# EAGLE design H1DR21 (EAGLE 9.6.1)

## Sheet 1 of 2
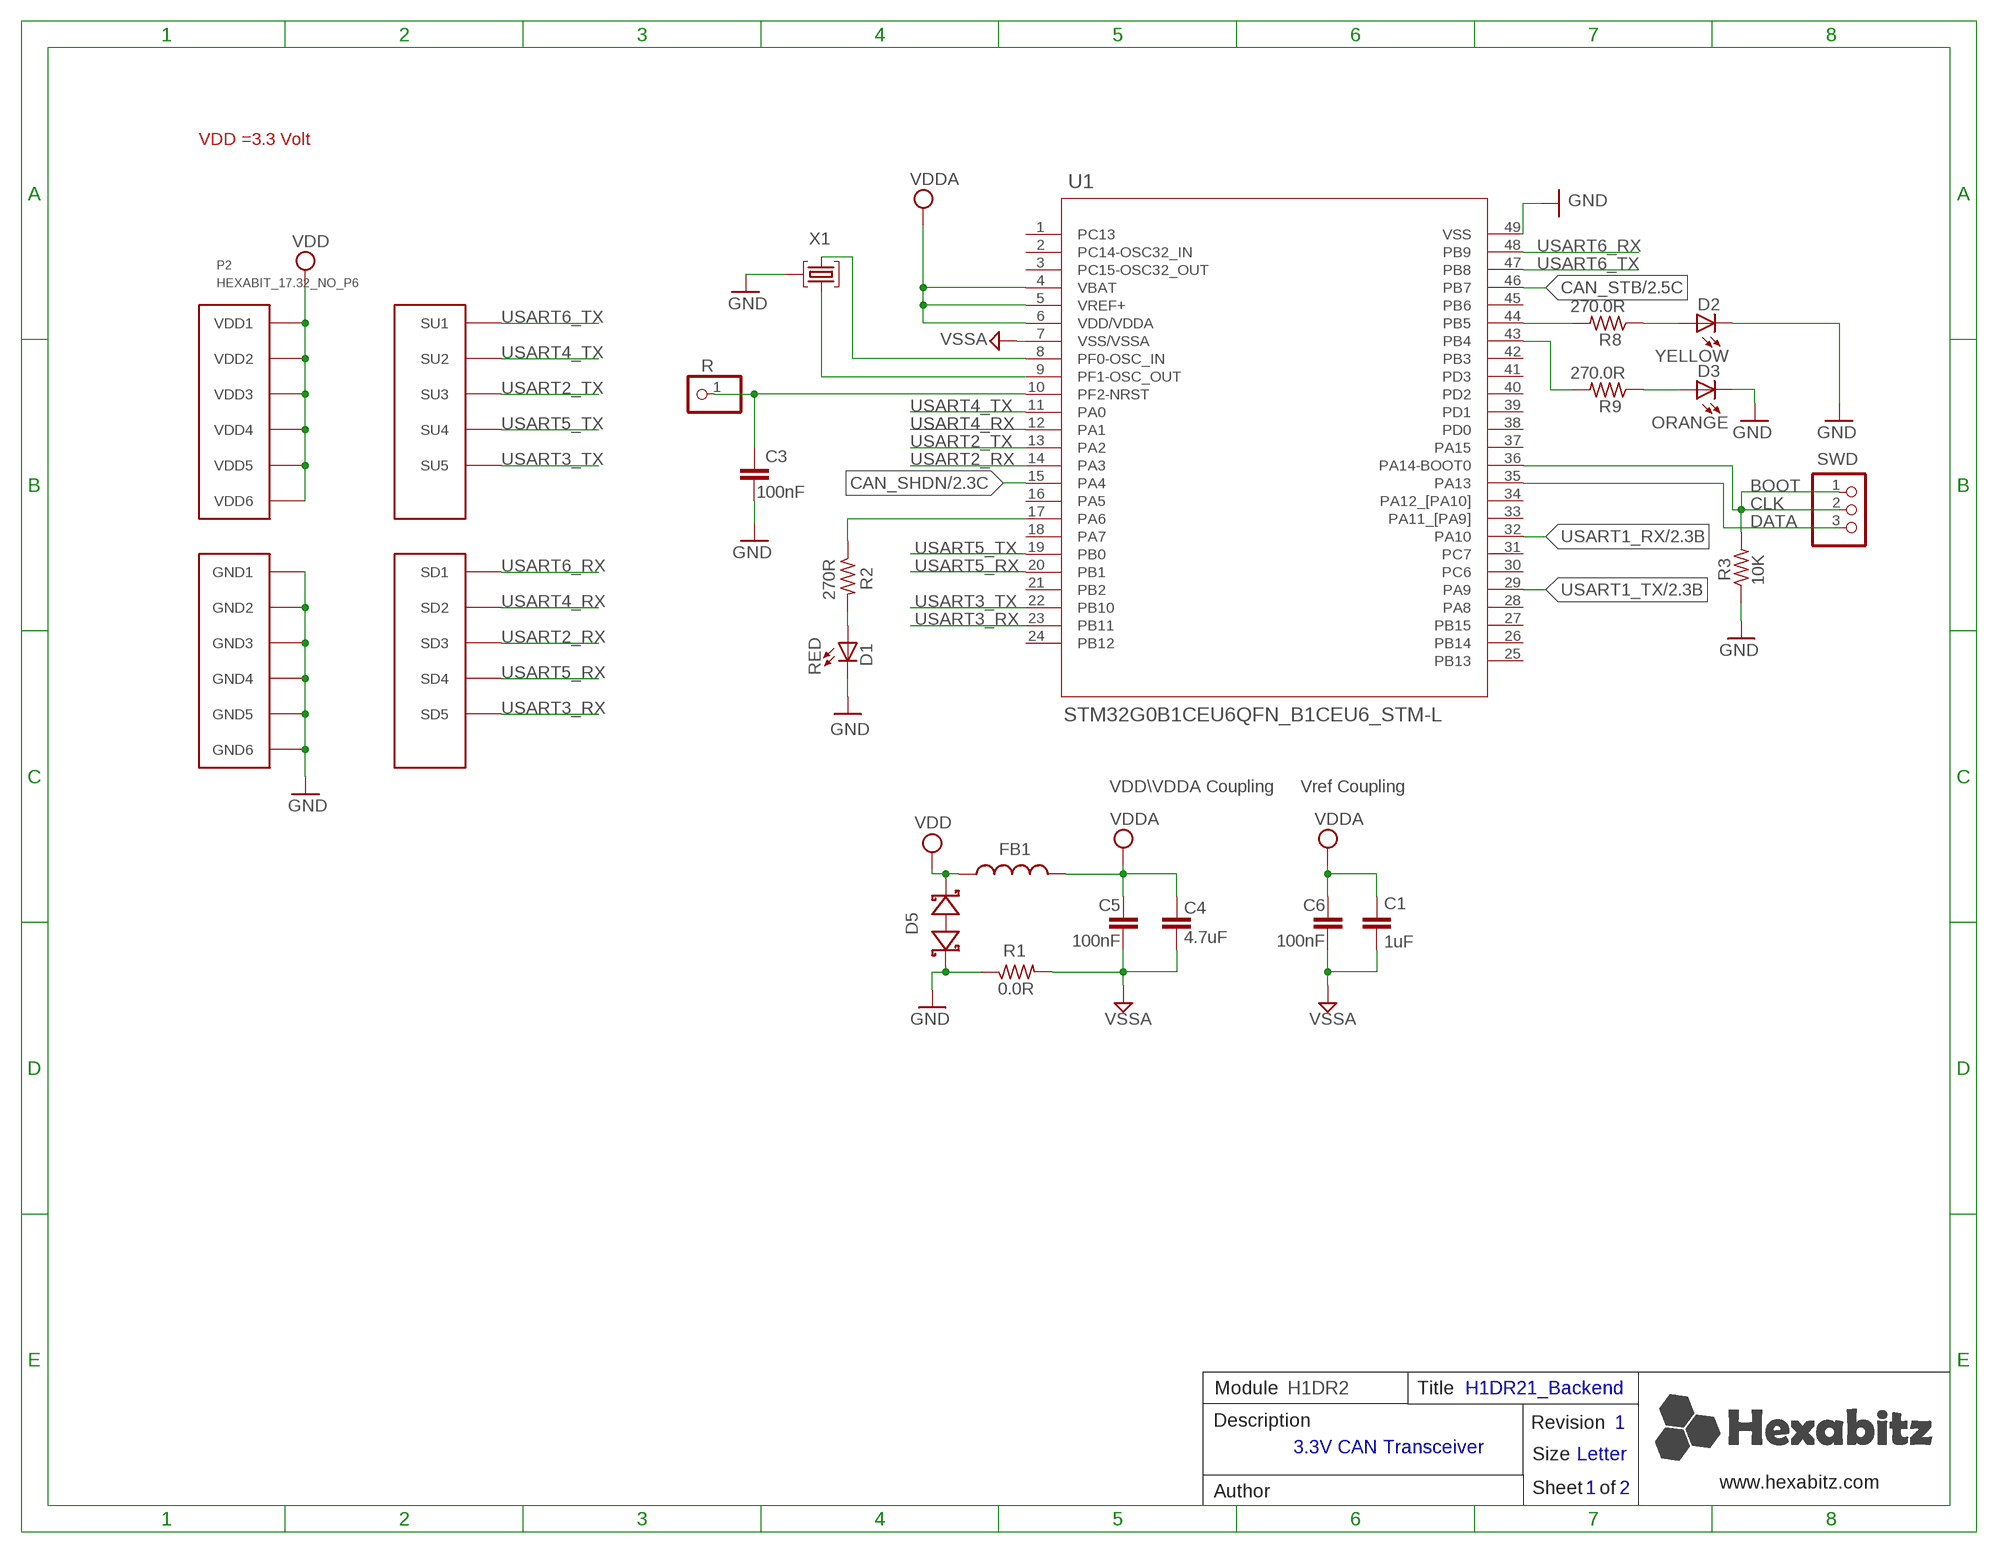
[diagram p0: schematic, sheet 1]

### Parts
C1  1uF  C-0805  [C-0805]
C3  100nF  C-0603  [C-0603]
C4  4.7uF  C-0805  [C-0805]
C5  100nF  C-0603  [C-0603]
C6  100nF  C-0603  [C-0603]
D1  RED  VLMS1300-GS08  [VLMS1300-GS08]
D2  YELLOW  VLMS1300-GS08  [VLMS1300-GS08]
D3  ORANGE  VLMS1300-GS08  [VLMS1300-GS08]
D5  BOURNS_CDSOD323-T03SCBOURNS_CDSOD323-T03SC_0_0  [BOURNS_CDSOD323-T03SC_0]
FB1  FB-TDK_MMZ1608Y300B  FB-0603  [FB-0603]
P2  HEXABIT_17.32_NO_P6  [HEXABIT_17.32_NO_P6]
R  R  PINHD-1X1  [1X01]
R1  0.0R  R-0603  [R-0603]
R2  270R  R-0603  [R-0603]
R3  10K  R-0603  [R-0603]
R8  270.0R  R-0603  [R-0603]
R9  270.0R  R-0603  [R-0603]
SWD  PINHD-1X3  [1X03]
U1  STM32G0B1CEU6QFN_B1CEU6_STM-L  [QFN_B1CEU6_STM-L]
X1  XTALL_CSTCE8M00G52  [XTALL_CSTCE8M00G52]

### Nets
CAN_SHDN: U1.15(PA4) ; also sheet 2
CAN_STB: U1.46(PB7) ; also sheet 2
CLK: R3.2 SWD.1 SWD.2 U1.36(PA14-BOOT0)
DATA: SWD.3 U1.35(PA13)
GND: C3.2 D1.C D2.C D3.C D5.1(A) P2.PAD_PD7(GND1) P2.PAD_PD8(GND2) P2.PAD_PD9(GND3) P2.PAD_PD10(GND4) P2.PAD_PD11(GND5) P2.PAD_PD12(GND6) R1.1 R3.1 U1.49(VSS) X1.P$2 ; also sheet 2
N$1: D1.A R2.2
N$2: D3.A R9.1
N$3: R2.1 U1.17(PA6)
N$4: C3.1 R.1 U1.10(PF2-NRST)
N$5: U1.9(PF1-OSC_OUT) X1.P$1
N$6: U1.8(PF0-OSC_IN) X1.P$3
N$7: D2.A R8.1
N$9: R8.2 U1.44(PB5)
N$11: R9.2 U1.43(PB4)
USART1_RX: U1.32(PA10) ; also sheet 2
USART1_TX: U1.29(PA9) ; also sheet 2
USART2_RX: P2.PAD_PD3(SD3) U1.14(PA3)
USART2_TX: P2.PAD_PU3(SU3) U1.13(PA2)
USART3_RX: P2.PAD_PD5(SD5) U1.23(PB11)
USART3_TX: P2.PAD_PU5(SU5) U1.22(PB10)
USART4_RX: P2.PAD_PD2(SD2) U1.12(PA1)
USART4_TX: P2.PAD_PU2(SU2) U1.11(PA0)
USART5_RX: P2.PAD_PD4(SD4) U1.20(PB1)
USART5_TX: P2.PAD_PU4(SU4) U1.19(PB0)
USART6_RX: P2.PAD_PD1(SD1) U1.48(PB9)
USART6_TX: P2.PAD_PU1(SU1) U1.47(PB8)
VDD: D5.2(C) FB1.2 P2.PAD_PU7(VDD1) P2.PAD_PU8(VDD2) P2.PAD_PU9(VDD3) P2.PAD_PU10(VDD4) P2.PAD_PU11(VDD5) P2.PAD_PU12(VDD6) ; also sheet 2
VDDA: C1.1 C4.1 C5.1 C6.1 FB1.1 U1.4(VBAT) U1.5(VREF+) U1.6(VDD/VDDA)
VSSA: C1.2 C4.2 C5.2 C6.2 R1.2 U1.7(VSS/VSSA)
Unconnected: U1.1(PC13) U1.2(PC14-OSC32_IN) U1.3(PC15-OSC32_OUT) U1.16(PA5) U1.18(PA7) U1.21(PB2) U1.24(PB12) U1.25(PB13) U1.26(PB14) U1.27(PB15) U1.28(PA8) U1.30(PC6) U1.31(PC7) U1.33(PA11_[PA9]) U1.34(PA12_[PA10]) U1.37(PA15) U1.38(PD0) U1.39(PD1) U1.40(PD2) U1.41(PD3) U1.42(PB3) U1.45(PB6)

### Notes on the sheet
- VDD =3.3 Volt
- BOOT
- VDD\VDDA Coupling | Vref Coupling
- Module | H1DR2 | Title | H1DR21_Backend￼
- Description | Revision | 1
- 3.3V CAN Transceiver
- Size | Letter
- www.hexabitz.com
- Author | Sheet   of | 1 | 2
- C:/Users/Admin/Desktop/logodraft.bmp

## Sheet 2 of 2
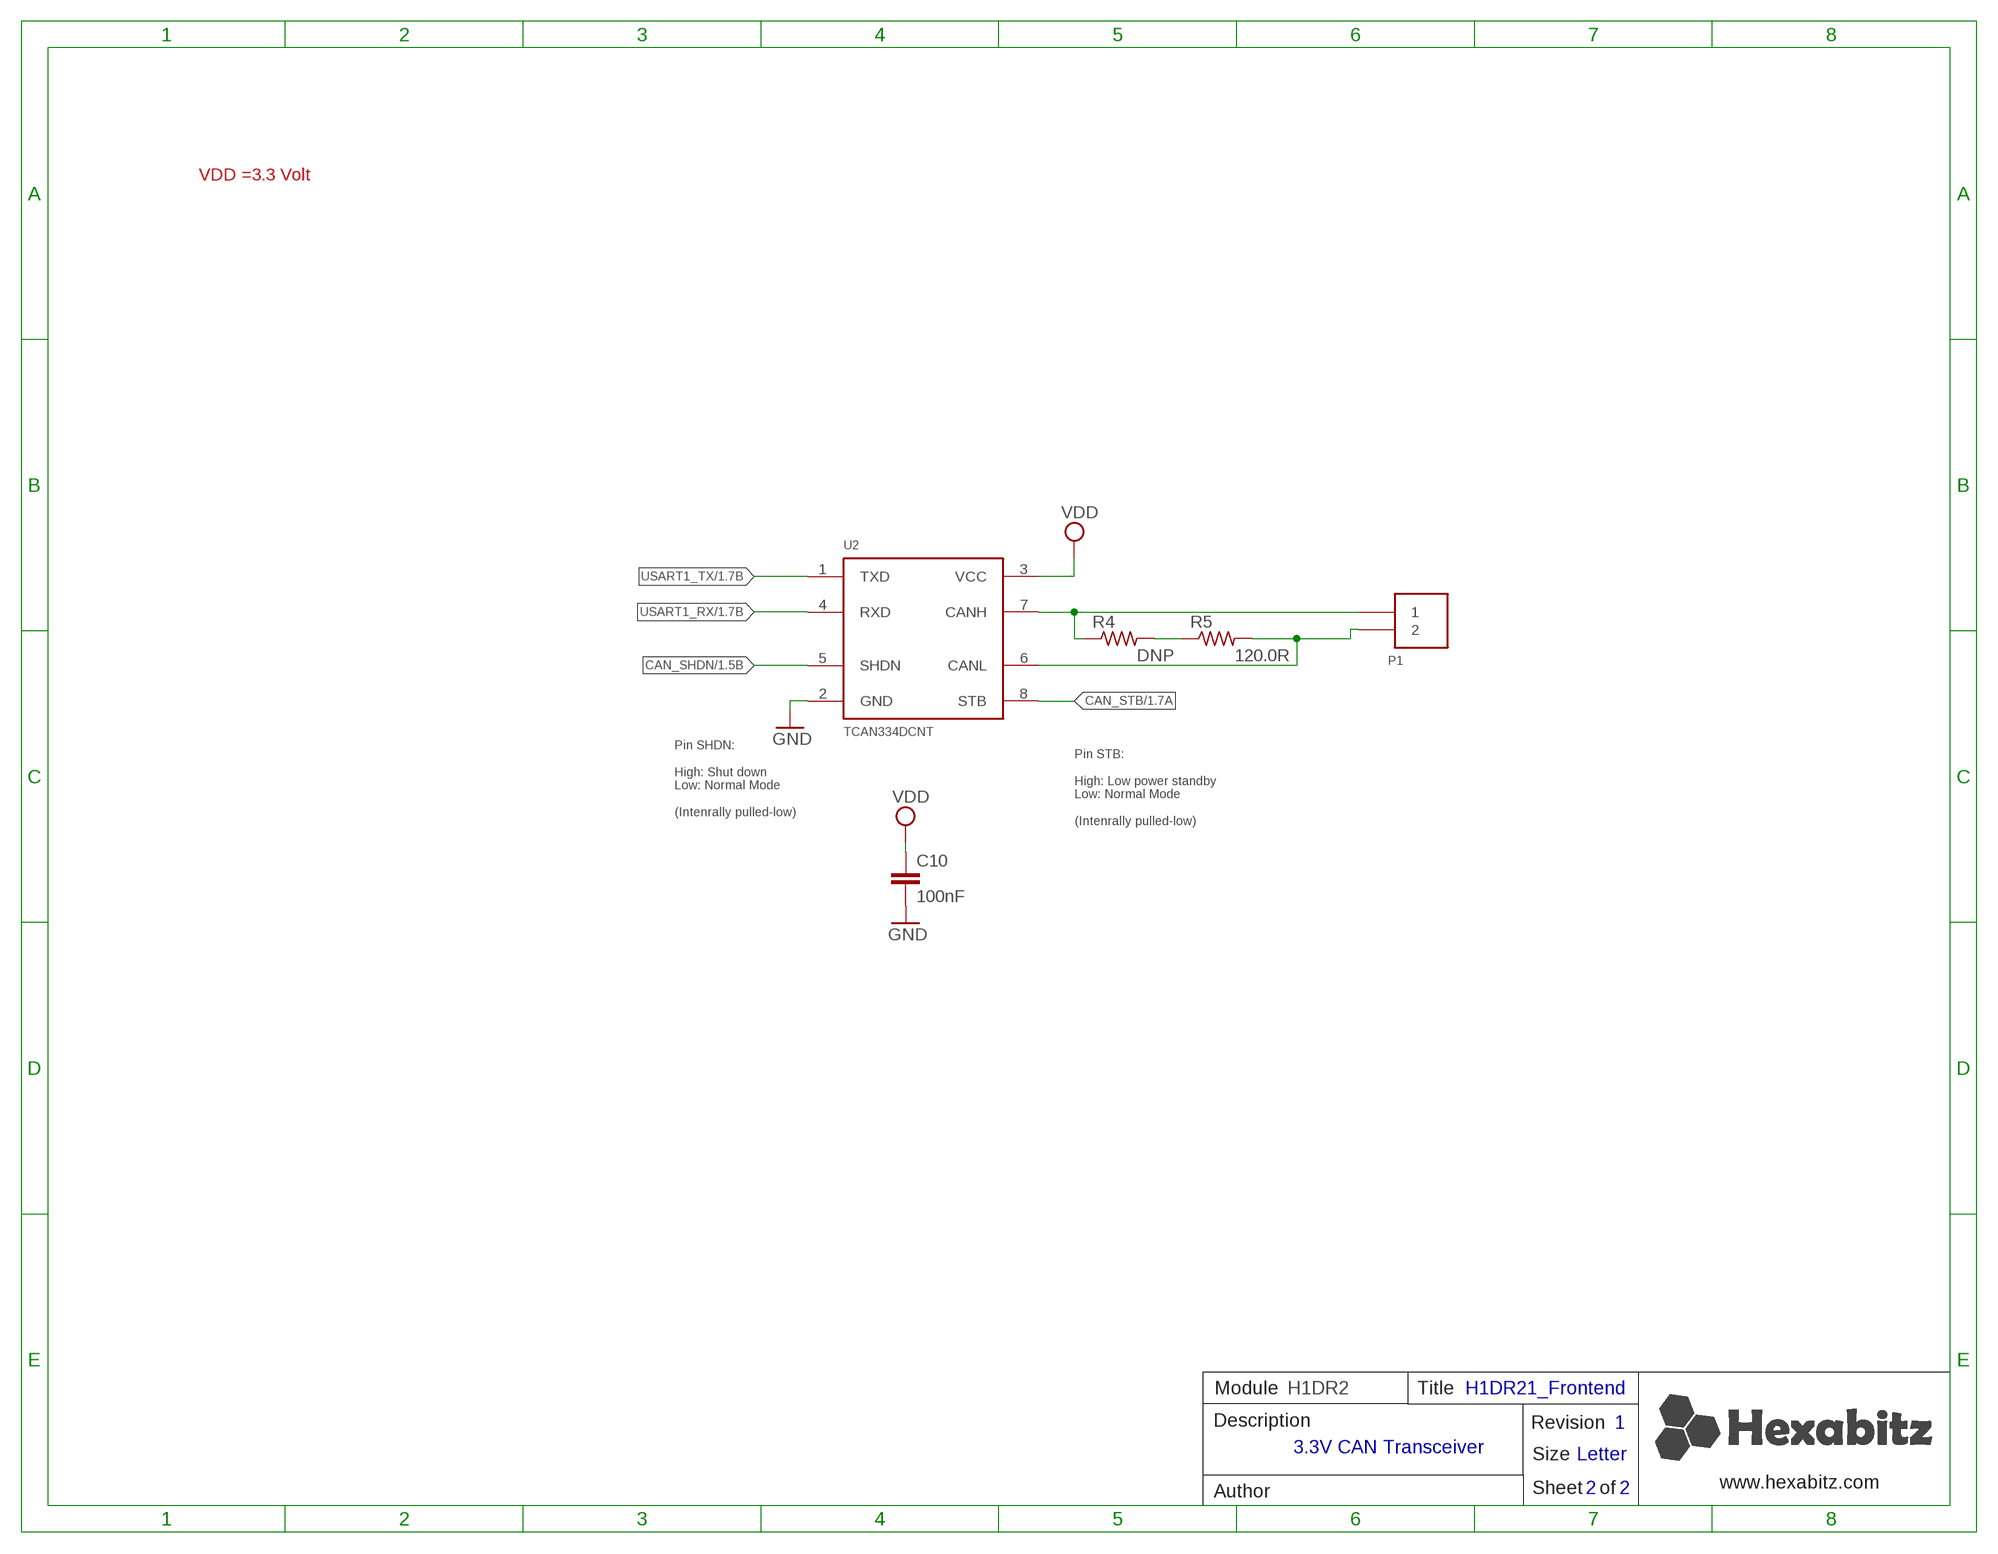
[diagram p1: schematic, sheet 2]

### Parts
C10  100nF  C-0603  [C-0603]
P1  1546111-2  [1546111-2]
R4  DNP  R-0603  [R-0603]
R5  120.0R  R-0603  [R-0603]
U2  TCAN334DCNT  [TCAN334DCNT]

### Nets
CAN_SHDN: U2.5(SHDN) ; also sheet 1
CAN_STB: U2.8(STB) ; also sheet 1
GND: C10.2 U2.2(GND) ; also sheet 1
N$12: P1.1 R4.1 U2.7(CANH)
N$13: R4.2 R5.1
N$16: P1.2 R5.2 U2.6(CANL)
USART1_RX: U2.4(RXD) ; also sheet 1
USART1_TX: U2.1(TXD) ; also sheet 1
VDD: C10.1 U2.3(VCC) ; also sheet 1

### Notes on the sheet
- VDD =3.3 Volt
- Pin SHDN:
  
  High: Shut down
  Low: Normal Mode
  
  (Intenrally pulled-low)
- Pin STB:
  
  High: Low power standby
  Low: Normal Mode
  
  (Intenrally pulled-low)
- Module | H1DR2 | Title | H1DR21_Frontend
- Description | Revision | 1
- 3.3V CAN Transceiver
- Size | Letter
- www.hexabitz.com
- Author | Sheet   of | 2 | 2
- C:/Users/Admin/Desktop/logodraft.bmp

## Library data of the parts
C1 C4 = HEXABITZ_RCLS:C-0805: CAP CER 10% X7R 0805
C3 C5 C6 = HEXABITZ_RCLS:C-0603: CAP CER 10% X7R 0603
C10 = Hexabitz:C-0603: CAP CER 10% X7R 0603; CAPACITANCE: 100nF; MFN: KEMET; MPN: C0603C104K8RACTU; OCTOPART_URL: https://octopart.com/c0603c104k8ractu-kemet-145075?r=sp&s=9bS9ASSwSEqMCE9KBEQZ0g; TOLERANCE: 10%; VOLTAGE_RATING: 10V
D1 = HEXABITZ_USER_INTERFACE_PARTS:VLMS1300-GS08: Red 0603 130° Clear 54 mcd 2 V Surface Mount ChipLED ; Octopart Url : http://octopart.com/vlms1300-gs08-vishay-21709201; MFN: Vishay; MPN: VLMS1300-GS08; OCTOPART_URL: https://octopart.com/vlms1300-gs08-vishay-21709201?r=sp&s=_gcP4_q8T1SC6PJQPTQ9yA
D2 D3 = HEXABITZ_USER_INTERFACE_PARTS:VLMS1300-GS08: Red 0603 130° Clear 54 mcd 2 V Surface Mount ChipLED ; Octopart Url : http://octopart.com/vlms1300-gs08-vishay-21709201; MFN: Vishay; MPN: VLMS1300-GS08; OCTOPART_URL: https://octopart.com/vlms1300-gs08-vishay-21709201?r=sp&s=_gcP4_q8T1SC6PJQPTQ9yA; VALUE: RED
D5 = HEXABITZ_RCLS:BOURNS_CDSOD323-T03SC: CDSOD323-TxxSC - TVS Diode Series; DESCRIPTION: Dio Tvs Vwm 03V 500W Bidir Sod323 / Tape & Reel - 7" Reel; MFN: Bourns; MPN: CDSOD323-T03SC; OCTOPART_URL: https://octopart.com/cdsod323-t03sc-bourns-10487153?r=sp
FB1 = HEXABITZ_RCLS:FB-0603: Ferrite Beads Multi-Layer 0603; MFN: TDK; MPN: MMZ1608Y300B; OCTOPART_URL: https://octopart.com/mmz1608y300b-tdk-368280?r=sp&s=cd9_2ZEqQ9q9UNBuQgHAiA
P1 = Hexabitz:1546111-2: Description : EUROSTYLE TB,HEADER,GREY,2 POS Parameter : Mounting Style : Through Hole, Number of Pins : 2, Octopart Url : https://octopart.com/1546111-2-te+connectivity-40393355, Current : 15 A Current Rating : 15 A Max Current Rating : 15 A Max Voltage Rating (AC) : 300 V Number of Contacts : 2 Number of Levels : 1 Number of Positions Per Level : 2 Orientation : Vertical Termination : Solder Voltage : 300 V Voltage Rating (AC) : 300 V; MFN: TE Connectivity; MPN: 1546111-2; OCTOPART_URL: https://octopart.com/1546111-2-te+connectivity-40393355
P2 = hexabitz_connectors:HEXABIT_?_NO_P6: Hexabitz Hexagon Module Connector Hexagon side length = 17.32mm. The following ports are removed: P6
R = HEXABITZ_USER_INTERFACE_PARTS:PINHD-1X1: PIN HEADER; MFN: TE Connectivity; MPN: 87227-1; OCTOPART_URL: https://octopart.com/87227-1-te+connectivity-39512052?r=sp
R1 = HEXABITZ_RCLS:R-0603: Thick Film Resistors - SMD 0603; MFN: Yageo; MPN: RC0603JR-070RL; OCTOPART_URL: https://octopart.com/rc0603jr-070rl-yageo-1241539?r=sp&s=X2NteqRjRNWrnx42Y0aliA; RESISTANCE: 0.0 Ohm
R2 R3 R8 R9 = HEXABITZ_RCLS:R-0603: Thick Film Resistors - SMD 0603
R4 = Hexabitz:R-0603: Thick Film Resistors - SMD 0603; MFN: Yageo; MPN: RC0603JR-070RL; OCTOPART_URL: https://octopart.com/search?q=RC0603JR-070RL; RESISTANCE: 0.0 Ohm
R5 = Hexabitz:R-0603: Thick Film Resistors - SMD 0603; MFN: Yageo; MPN: AC0603FR-07120RL; OCTOPART_URL: https://octopart.com/search?q=AC0603FR-07120RL&start=0; RESISTANCE: 120.0 Ohm; TOLERANCE: 1%
SWD = pinhead:PINHD-1X3: PIN HEADER
U1 = HEXABITZ_ICs:STM32G0B1CEU6; COPYRIGHT: Copyright (C) 2021 Ultra Librarian. All rights reserved.; MANUFACTURER_PART_NUMBER: STM32G0B1CEU6; MFR_NAME: STMicroelectronics; SPICEPREFIX: X
U2 = Hexabitz:TCAN334DCNT: Description : 3.3-V CAN Transceivers 8-SOT-23 -40 to 125; Parameter : Lifecycle Status : Active, Mounting Style : Surface Mount, Number of Pins : 8, Interface : CAN Max Operating Temperature : 125 °C Max Supply Voltage : 3.6 V Min Operating Temperature : -40 °C Min Supply Voltage : 3 V Octopart Url : https://octopart.com/tcan334dcnt-texas+instruments-70835167?r=sp&s=90JNHpOERMGGNru9w1_R2Q, OctopartID : 5f4f955c32ec8088, REACH SVHC Compliance : No SVHC, RoHS : Non-Compliant,; MFN: Texas Instruments; MPN: TCAN334DCNT; OCTOPART_URL: https://octopart.com/tcan334dcnt-texas+instruments-70835167?r=sp&s=90JNHpOERMGGNru9w1_R2Q
X1 = HEXABITZ_RCLS:XTALL_CSTCE8M00G52: MURATA CSTCE8M00G52-R0 RESONATOR, SMD, 8MHZ ; Octopart Url : https://octopart.com/cstce8m00g52-r0-murata-7145559; MFN: Murata; MPN: CSTCE8M00G52Z-R0; OCTOPART_URL: https://octopart.com/cstce8m00g52z-r0-murata-17755941?r=sp&s=JDnNJnrHQhyS8Zk4ofFWXw

## Board
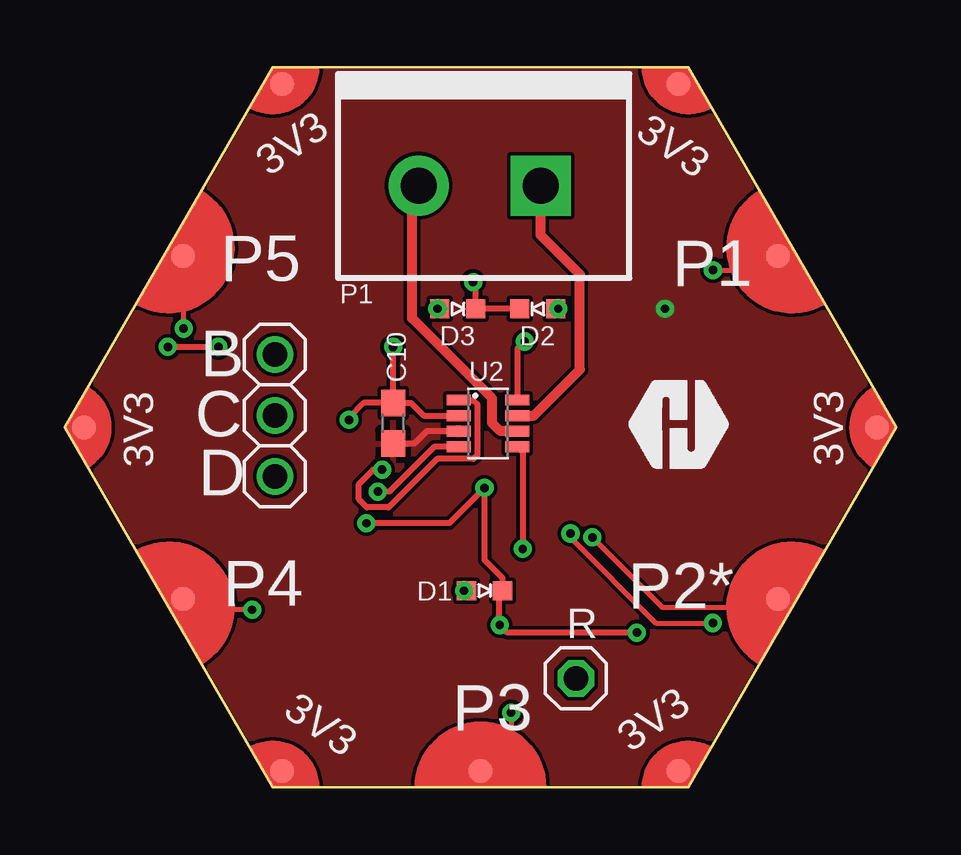
[diagram p2: board, top side]
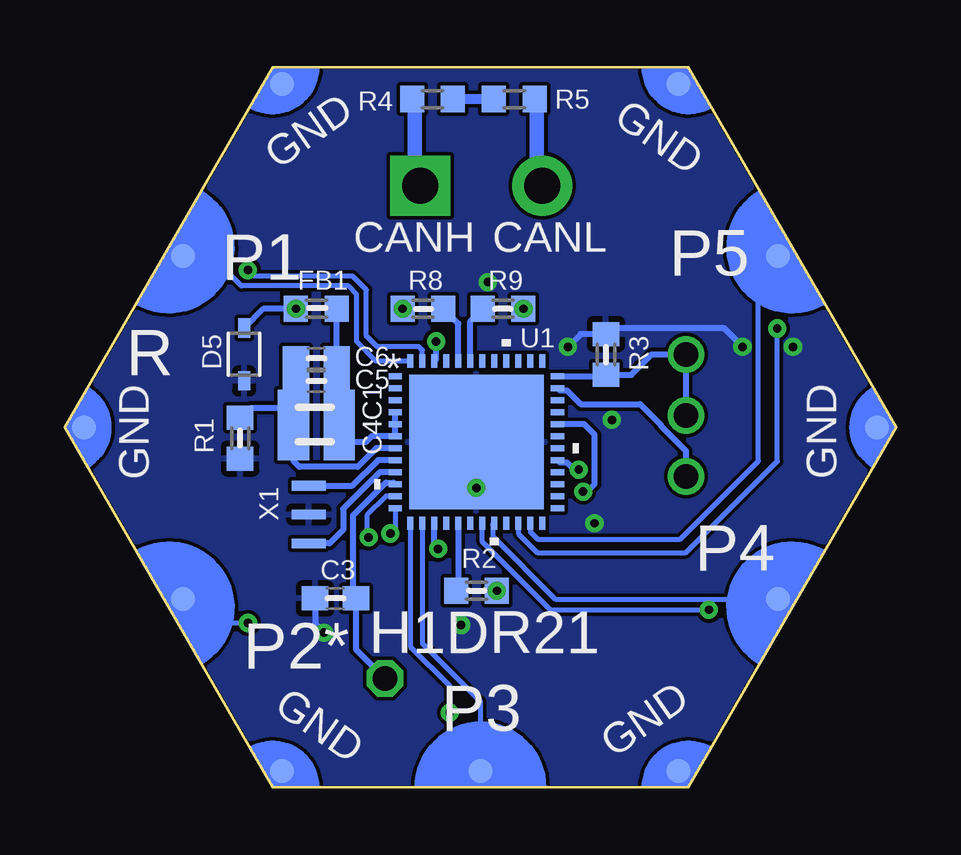
[diagram p3: board, bottom side, seen from below]

Size 34.64 x 30 mm. Coordinates in mm from the lower left corner, seen from the top.
Copper layers (1*16): Top 0.035mm / dielectric 1.5mm / Bottom 0.035mm
Design rules "2layers_Board": minimum track width 7mil, minimum drill 10mil, track to track 6mil, track to pad 6mil, pad to pad 6mil, via to via 6mil, smd to smd 0mil, copper to edge 1mil, drill to drill 8mil, minimum pad ring 10mil, minimum via ring 8mil, stop-mask expansion 2mil, vias tented up to drill 15mil, thermal gap 10mil

### Footprints (pad centres in the part's own frame; a part is rotated, then mirrored left to right if it is on the bottom)
C-0805 = smd 1.3 x 1.5: 1 -0.95,0; 2 0.95,0
C-0603 = smd 1.1 x 1: 1 -0.85,0; 2 0.85,0
VLMS1300-GS08 = smd 0.8 x 0.8: A 0,0.75; C 0,-0.75
BOURNS_CDSOD323-T03SC_0 = smd 0.8 x 0.5: 1 -1.1,0; 2 1.1,0
FB-0603 = smd 1 x 1.1: 1 -0.85,0; 2 0.85,0
1546111-2 = drill 1.5 pad 2.5 square: 1 -2.54,0 | drill 1.5 pad 2.5: 2 2.54,0
HEXABIT_17.32_NO_P6 = smd 1 x 1 bottom: PAD_PD1 12.39,7.15; PAD_PD2 12.39,-7.15; PAD_PD3 0,-14.31; PAD_PD4 -12.39,-7.15; PAD_PD5 -12.39,7.15; PAD_PD7 8.26,14.31; PAD_PD8 16.52,0; PAD_PD9 8.26,-14.31; PAD_PD10 -8.26,-14.31; PAD_PD11 -16.52,0; PAD_PD12 -8.26,14.31 | smd 1 x 1: PAD_PU1 12.39,7.15; PAD_PU2 12.39,-7.15; PAD_PU3 0,-14.31; PAD_PU4 -12.39,-7.15; PAD_PU5 -12.39,7.15; PAD_PU7 8.26,14.31; PAD_PU8 16.52,0; PAD_PU9 8.26,-14.31; PAD_PU10 -8.26,-14.31; PAD_PU11 -16.52,0; PAD_PU12 -8.26,14.31
1X01 = drill 1.016 octagon: 1 0,0
R-0603 = smd 1 x 1.1: 1 -0.85,0; 2 0.85,0
1X03 = drill 1.016: 1 -2.54,0; 2 0,0; 3 2.54,0
QFN_B1CEU6_STM-L = smd 0.55 x 0.254: 1 -3.38,2.751; 2 -3.38,2.251; 3 -3.38,1.75; 4 -3.38,1.25; 5 -3.38,0.75; 6 -3.38,0.25; 7 -3.38,-0.25; 8 -3.38,-0.75; 9 -3.38,-1.25; 10 -3.38,-1.75; 11 -3.38,-2.251; 12 -3.38,-2.751; 25 3.38,-2.751; 26 3.38,-2.251; 27 3.38,-1.75; 28 3.38,-1.25; 29 3.38,-0.75; 30 3.38,-0.25; 31 3.38,0.25; 32 3.38,0.75; 33 3.38,1.25; 34 3.38,1.75; 35 3.38,2.251; 36 3.38,2.751 | smd 0.254 x 0.55: 13 -2.751,-3.38; 14 -2.251,-3.38; 15 -1.75,-3.38; 16 -1.25,-3.38; 17 -0.75,-3.38; 18 -0.25,-3.38; 19 0.25,-3.38; 20 0.75,-3.38; 21 1.25,-3.38; 22 1.75,-3.38; 23 2.251,-3.38; 24 2.751,-3.38; 37 2.751,3.38; 38 2.251,3.38; 39 1.75,3.38; 40 1.25,3.38; 41 0.75,3.38; 42 0.25,3.38; 43 -0.25,3.38; 44 -0.75,3.38; 45 -1.25,3.38; 46 -1.75,3.38; 47 -2.251,3.38; 48 -2.751,3.38 | smd 5.6 x 5.6: 49 0,0
TCAN334DCNT = smd 0.45 x 1: 1 -0.975,-1.225; 2 -0.325,-1.225; 3 0.325,-1.225; 4 0.975,-1.225; 5 0.975,1.225; 6 0.325,1.225; 7 -0.325,1.225; 8 -0.975,1.225
XTALL_CSTCE8M00G52 = smd 1.4 x 0.4: P$1 0,1.2; P$2 0,0; P$3 0,-1.2

### Placement (x,y rotation side)
C1  24.16,15.82 180 bottom
C3  23.36,7.88 180 bottom
C4  24.16,14.39 180 bottom
C5  24.16,16.93 180 bottom
C6  24.16,17.88 180 bottom
C10  13.68,15.17 90 top
D1  17.49,8.2 90 top
D2  19.71,19.94 270 top
D3  16.38,19.94 90 top
D5  27.17,18.04 90 bottom
FB1  24.16,19.94 180 bottom
P1  17.28,25.08 180 top
P2  17.32,15 0 top
R  21.3,4.54 0 top
R1  27.33,14.55 90 bottom
R2  17.49,8.2 0 bottom
R3  12.09,18.04 270 bottom
R4  19.32,28.68 0 bottom
R5  15.91,28.68 0 bottom
R8  19.71,19.94 0 bottom
R9  16.38,19.94 180 bottom
SWD  8.76,15.5 270 top
U1  17.49,14.39 0 bottom
U2  17.63,15.17 270 top
U$1  [HEXA-LOGO]  25.58,13.28 0 top
X1  24.47,11.37 180 bottom

### Tracks (layer width: path | path; a pad name or v marks a point on that pad's centre or on a via)
CAN_SHDN  (via drill 0.35)
  Top 0.254: U2.5 19.08,13.97 v19.08,9.94
  Bottom 0.254: v19.08,9.94 19.24,10.1 U1.15
CAN_STB  (via drill 0.35)
  Top 0.254: v19.17,18.58 18.86,18.27 U2.8
  Bottom 0.254: U1.46 19.17,17.84 v19.17,18.58
CLK
  Bottom 0.254: U1.36 12.14,17.14 R3.2 11.04,17.19 10.19,18.04 SWD.1 SWD.2
DATA
  Bottom 0.254: U1.35 14.01,16.54 13.72,16.54 13.15,15.98 10.66,15.98 9.8,15.11 9.8,15.07 8.76,14.03 SWD.3
GND  (via drill 0.35)
  Top 0.254: D2.C D3.C 17.13,20.94 v17.01,21.06 | C10.2 v13.68,18.36 | v23.84,6.45 18.44,6.45 v18.12,6.77 18.08,6.81 18.08,8.04 D1.C 18.24,8.72 17.49,9.47 v17.49,12.48 16.02,11.01 v12.57,11.01 | C10.2 12.46,16.02 11.84,15.41 v11.84,15.32 | C10.2 14.42,16.02 14.96,15.49 U2.2 | v4.3,18.36 v6.4,18.36
  Bottom 0.254: v6.4,18.36 7.19,19.15 11.83,19.15 R3.1 13.15,18.89 v13.68,18.36 | C3.2 24.21,6.82 v23.84,6.45 | v17.49,12.48 U1.49
  pour Bottom: 0.11,14.94 8.75,29.93 26.02,29.93 34.66,14.94 26.02,-0.04 8.75,-0.04
N$1  (via drill 0.35)
  Top 0.254: R2.2 D1.A
  other vias: 16.64,8.2
N$2  (via drill 0.35)
  Top 0.254: D3.A R9.1
  other vias: 15.53,19.94
N$3
  Bottom 0.254: U1.17 18.24,8.3 R2.1
N$4
  Bottom 0.254: U1.10 20.93,12.7 21.26,12.7 22.64,11.32 22.64,8.01 C3.1 22.51,5.76 R.1
N$5
  Bottom 0.254: U1.9 21.51,13.14 23.04,11.6 23.04,10.74 23.61,10.17 X1.P$1
N$6
  Bottom 0.254: U1.8 21.59,13.64 22.65,12.57 X1.P$3
N$7  (via drill 0.35)
  Top 0.254: D2.A R8.1
  other vias: 20.56,19.94
N$9
  Bottom 0.254: U1.44 18.24,19.32 R8.2
N$11
  Bottom 0.254: U1.43 17.74,19.43 R9.2
N$12
  Top 0.406: U2.7 19.54,15.49 21.46,17.4 21.46,21.38 19.82,23.01 P1.1
  Bottom 0.61: R4.1 20.05,28.57 20.05,25.3 P1.1
N$13
  Bottom 0.406: R5.1 R4.2
N$16
  Top 0.406: P1.2 14.47,24.81 14.47,19.55 17.81,16.21 17.81,15.18 18.15,14.84 U2.6
  Bottom 0.61: R5.2 14.97,28.59 14.97,25.3 P1.2
USART1_RX  (via drill 0.35)
  Top 0.254: U2.4 15.39,14.19 13.52,12.32 v13.04,12.32
  Bottom 0.254: v13.04,12.32 12.88,12.32 12.57,12.64 12.57,14.71 13,15.14 U1.32
USART1_TX  (via drill 0.35)
  Top 0.254: U2.1 17,16.14 17.19,15.96 17.19,13.85 17.02,13.69 15.52,13.69 13.5,11.67 12.59,11.67 12.25,12.01 12.25,12.64 12.85,13.24 v13.22,13.24
  Bottom 0.254: U1.29 14.01,13.54 13.72,13.54 13.42,13.24 v13.22,13.24
USART2_RX
  Bottom 0.203: U1.14 19.74,6 17.32,3.58 P2.PAD_PD3
USART2_TX  (via drill 0.35)
  Top 0.203: v18.6,3.12 18.6,1.97 P2.PAD_PU3
  Bottom 0.203: U1.13 20.24,5.87 18.6,4.23 v18.6,3.12
USART3_RX
  Bottom 0.203: U1.23 15.24,10.65 14.94,10.35 8.99,10.35 5.74,13.59 5.74,21.34 P2.PAD_PD5
USART3_TX  (via drill 0.35)
  Top 0.203: v4.95,19.12 4.95,22.13
  Top 0.254: 4.95,22.13 P2.PAD_PU5
  Bottom 0.203: U1.22 15.74,10.57 14.95,9.78 8.76,9.78 4.95,13.59 v4.95,19.12
USART4_RX  (via drill 0.35)
  Top 0.203: v21.07,10.58 21.07,10.4 24.62,6.85 v27,6.85
  Bottom 0.203: U1.12 20.87,10.78 v21.07,10.58 | v27,6.85 28.71,6.85 P2.PAD_PD2
USART4_TX  (via drill 0.35)
  Top 0.203: v21.98,10.42 24.89,7.51 29.37,7.51
  Top 0.254: 29.37,7.51 P2.PAD_PU2
  Bottom 0.203: U1.11 21.25,12.14 22.05,11.33 22.05,10.49
  Bottom 0.254: 22.05,10.49 v21.98,10.42
USART5_RX
  Bottom 0.203: 16.8,10.94 16.8,10.46 14.2,7.85 P2.PAD_PD4
  Bottom 0.254: U1.20 16.8,10.94
USART5_TX  (via drill 0.35)
  Top 0.203: v7.8,7.4 5.38,7.4 P2.PAD_PU4
  Bottom 0.203: v7.8,7.4 14.41,7.4 17.24,10.23 U1.19
USART6_RX
  Bottom 0.203: U1.48 21.66,17.77 22.48,18.58 22.48,20.56 22.81,20.9 27.28,20.9 28.54,22.15 P2.PAD_PD1
USART6_TX  (via drill 0.35)
  Top 0.203: v27.01,21.55 29.11,21.55 P2.PAD_PU1
  Bottom 0.203: U1.47 19.74,18.23 19.87,18.36 21.62,18.36 22.07,18.81 22.07,20.73 22.64,21.3 26.76,21.3 v27.01,21.55
VDD  (via drill 0.35)
  Top 0.254: U2.3 15.08,14.84 14.57,14.32 C10.1
  Bottom 0.254: FB1.2 26.37,19.94 D5.2
  other vias: 25.01,19.94
  pour Top: 8.75,29.93 0.11,14.94 8.75,-0.04 26.02,-0.04 34.66,14.94 26.02,29.93
VDDA
  Bottom 0.254: U1.4 U1.5 U1.6 21.84,14.64 22.09,14.39 C4.1 C1.1 23.21,16.83 C5.1 C6.1 FB1.1
VSSA
  Bottom 0.254: U1.7 21.66,14.14 22.44,13.36 24.87,13.36 25.11,13.59 C4.2 C1.2 | C6.2 C5.2 25.01,15.92 C1.2 | R1.2 26.91,15.82 C1.2

### Text on the board
tNames: 3V3 | 3V3 | P5 | P1 | B | C | D | 3V3 | 3V3 | P4 | P2* | 3V3 | P3 | 3V3
bNames: GND | GND | CANL | CANH | P5 | P1 | R | GND | GND | P4 | P2* | H1DR21 | P3 | GND | GND